# EAGLE design Breakout2-rc-1-9 (EAGLE 5.12)
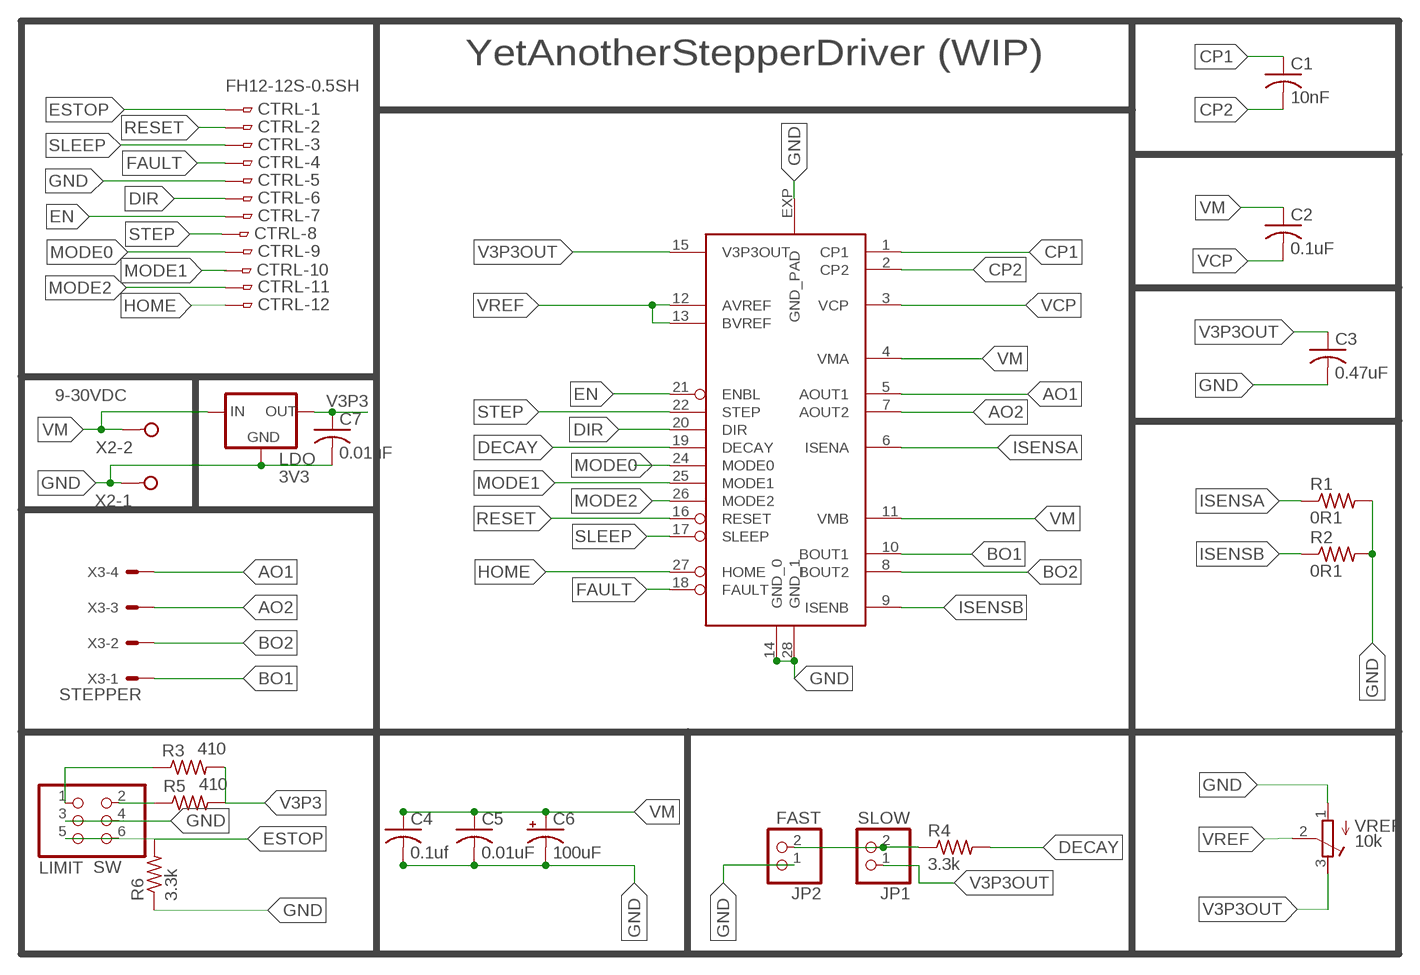
[diagram p0: schematic, sheet 1]

## Parts
C1  10nF  C-USC0805K  [C0805K]
C2  0.1uF  C-USC0805  [C0805]
C3  0.47uF  C-USC0805  [C0805]
C4  0.1uf  C-USC1206  [C1206]
C5  0.01uF  C-USC0805  [C0805]
C6  100uF  CPOL-USE5-8.5  [E5-8,5]
C7  0.01uF  C-USC0805  [C0805]
CTRL  FH12-12S-0.5SH  [FH12-12S-0.5SH]
JP1  SLOW  PINHD-1X2  [1X02]
JP2  FAST  PINHD-1X2  [1X02]
LDO  3V3  78LXX  [78LXX]
R1  0R1  R-US_R2512  [R2512]
R2  0R1  R-US_R2512  [R2512]
R3  410  R-US_R0805  [R0805]
R4  3.3k  R-US_R0805  [R0805]
R5  410  R-US_R0805  [R0805]
R6  3.3k  R-US_R0805  [R0805]
SW  LIMIT  PINHD-2X3  [2X03]
U1  DRV8825PWP  [TSSOP-28]
VREF  10k  R-TRIMM3304W  [RTRIM3304W]
X2  9-30VDC  W237-02P  [W237-132]
X3  STEPPER  KK-156-4  [KK-156-4]

## Nets
AO1: U1.5(AOUT1) X3.4
AO2: U1.7(AOUT2) X3.3
BO1: U1.10(BOUT1) X3.1
BO2: U1.8(BOUT2) X3.2
CP1: C1.1 U1.1(CP1)
CP2: C1.2 U1.2(CP2)
DECAY: R4.2 U1.19(DECAY)
DIR: CTRL.6 U1.20(DIR)
EN: CTRL.7 U1.21(ENBL)
ESTOP: CTRL.1 R6.2 SW.5 SW.6
FAULT: CTRL.4 U1.18(FAULT)
GND: C3.2 C4.2 C5.2 C6.- C7.2 CTRL.5 JP2.1 LDO.GND R1.2 R2.2 R6.1 SW.3 SW.4 U1.14(GND_0) U1.28(GND_1) U1.EXP(GND_PAD) VREF.1(A) X2.1
HOME: CTRL.12 U1.27(HOME)
ISENSA: R1.1 U1.6(ISENA)
ISENSB: R2.1 U1.9(ISENB)
MODE0: CTRL.9 U1.24(MODE0)
MODE1: CTRL.10 U1.25(MODE1)
MODE2: CTRL.11 U1.26(MODE2)
N$1: R5.1 SW.2
N$4: JP1.2 JP2.2 R4.1
N$7: R3.1 SW.1
RESET: CTRL.2 U1.16(RESET)
SLEEP: CTRL.3 U1.17(SLEEP)
STEP: CTRL.8 U1.22(STEP)
V3P3: C7.1 LDO.OUT R3.2 R5.2
V3P3OUT: C3.1 JP1.1 U1.15(V3P3OUT) VREF.3(E)
VCP: C2.2 U1.3(VCP)
VM: C2.1 C4.1 C5.1 C6.+ LDO.IN U1.4(VMA) U1.11(VMB) X2.2
VREF: U1.12(AVREF) U1.13(BVREF) VREF.2(S)

## Notes on the sheet
- YetAnotherStepperDriver (WIP)

## Library data of the parts
C1-C5 C7 = rcl:C-US: CAPACITOR, American symbol
C6 = rcl:CPOL-US: POLARIZED CAPACITOR, American symbol
CTRL = con-hirose:FH12-12S-0.5S: 0.5mm Pitch Connectors For FPC/FFC Source: Data sheet <http://www.hirose.co.jp/cataloge_hp/e58605370.pdf>; MPN: FH12-12S-0.5SH(55); OC_FARNELL: 1324542; OC_NEWARK: 34M6155
JP1 JP2 = pinhead:PINHD-1X2: PIN HEADER
LDO = v-reg:78LXX: VOLTAGE REGULATOR
R1-R6 = rcl:R-US_: RESISTOR, American symbol
SW = pinhead:PINHD-2X3: PIN HEADER
U1 = drv88xx:DRV8825PWP
VREF = rcl:R-TRIMM: Trimm resistor
X2 = con-wago-508:W237-02P: WAGO SREW CLAMP; OC_FARNELL: unknown; OC_NEWARK: unknown
X3 = con-molex:KK-156-4: KK 156 HEADER Source: http://www.molex.com/pdm_docs/sd/026604100_sd.pdf; OC_FARNELL: unknown; OC_NEWARK: unknown

## Board
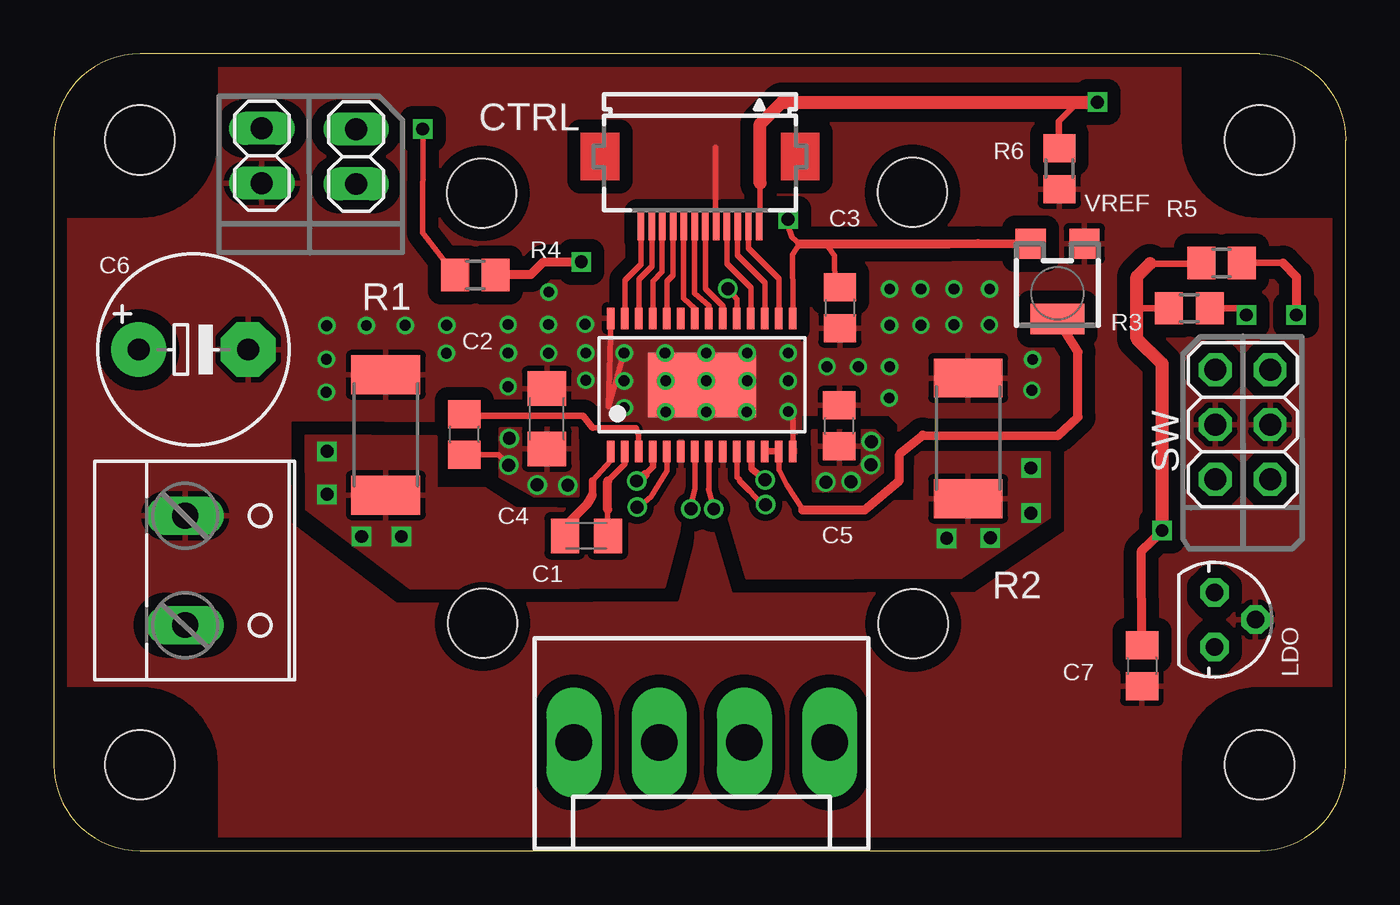
[diagram p1: board, top side]
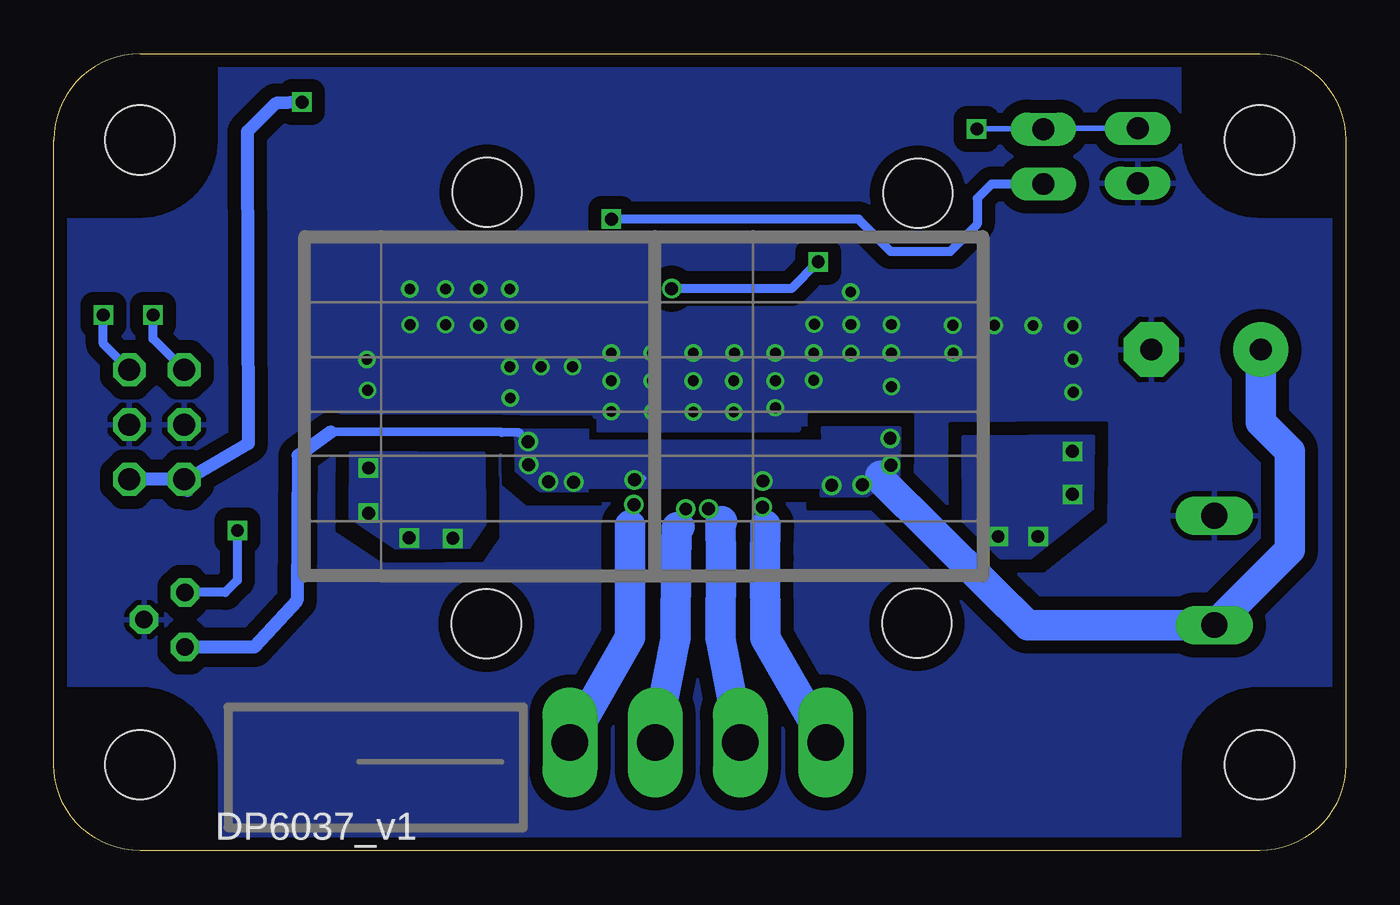
[diagram p2: board, bottom side, seen from below]

Size 60 x 37 mm. Coordinates in mm from the lower left corner, seen from the top.
Copper layers (1*16): Top 0.035mm / dielectric 1.5mm / Bottom 0.035mm
Design rules "Fusion_eagle_rule_v1.1": minimum track width 6mil, minimum drill 12mil, track to track 6mil, track to pad 6mil, pad to pad 6mil, via to via 6mil, smd to smd 0mil, copper to edge 10mil, drill to drill 10mil, minimum pad ring 10mil, minimum via ring 6mil, stop-mask expansion 2mil, vias tented up to drill 100mil, thermal gap 10mil
Holes 3.2 mm at 19.92,10.56 19.88,30.52 39.87,30.58 39.91,10.53

### Footprints (pad centres in the part's own frame; a part is rotated, then mirrored left to right if it is on the bottom)
C0805K = smd 1.3 x 1.6: 1 -1,0; 2 1,0
C0805 = smd 1.3 x 1.5: 1 -0.95,0; 2 0.95,0
C1206 = smd 1.6 x 1.8: 1 -1.4,0; 2 1.4,0
E5-8,5 = drill 1.016 pad 2.54 round: + -2.54,0 | drill 1.016 pad 2.54 octagon: - 2.54,0
FH12-12S-0.5SH = smd 0.3 x 1.3: 1 -2.75,3.25; 2 -2.25,3.25; 3 -1.75,3.25; 4 -1.25,3.25; 5 -0.75,3.25; 6 -0.25,3.25; 7 0.25,3.25; 8 0.75,3.25; 9 1.25,3.25; 10 1.75,3.25; 11 2.25,3.25; 12 2.75,3.25
1X02 = drill 1.016 long: 1 -1.27,0; 2 1.27,0
78LXX = drill 0.813 octagon: GND 0,1.905; IN 1.27,0; OUT -1.27,0
R2512 = smd 1.8 x 3.2: 1 -2.8,0; 2 2.8,0
R0805 = smd 1.3 x 1.5: 1 -0.95,0; 2 0.95,0
2X03 = drill 1.016 octagon: 1 -2.54,-1.27; 2 -2.54,1.27; 3 0,-1.27; 4 0,1.27; 5 2.54,-1.27; 6 2.54,1.27
TSSOP-28 = smd 0.35 x 1: 1 -4.225,-3.087; 2 -3.575,-3.087; 3 -2.925,-3.087; 4 -2.275,-3.087; 5 -1.625,-3.087; 6 -0.975,-3.087; 7 -0.325,-3.087; 8 0.325,-3.087; 9 0.975,-3.087; 10 1.625,-3.087; 11 2.275,-3.087; 12 2.925,-3.087; 13 3.575,-3.087; 14 4.225,-3.087; 15 4.225,3.087; 16 3.575,3.087; 17 2.925,3.087; 18 2.275,3.087; 19 1.625,3.087; 20 0.975,3.087; 21 0.325,3.087; 22 -0.325,3.087; 23 -0.975,3.087; 24 -1.625,3.087; 25 -2.275,3.087; 26 -2.925,3.087; 27 -3.575,3.087; 28 -4.225,3.087 | smd 5 x 3: EXP 0,0
DP6037_V1 = hole 3.2: 4,4; 56,4; 56,33; 4,33
RTRIM3304W = smd 1.4 x 1.4: 1 -1.25,-1.9; 3 1.25,-1.9 | smd 2.5 x 1.4: 2 0,1.6
W237-132 = drill 1.194 long: 1 -2.54,-0.635; 2 2.54,-0.635
KK-156-4 = drill 1.7 pad 2.184 long: 1 -5.94,0; 2 -1.98,0; 3 1.98,0; 4 5.94,0

### Placement (x,y rotation side)
C1  24.74,14.62 0 top
C2  19.07,19.33 90 top
C3  36.51,25.22 270 top
C4  22.9,20.06 90 top
C5  36.48,19.72 90 top
C6  6.48,23.27 0 top
C7  50.54,8.58 270 top
CTRL  30.01,32.23 180 top
JP1  14.04,32.23 90 top
JP2  9.66,32.27 90 top
LDO  53.91,10.73 270 top
R1  15.41,19.3 90 top
R2  42.46,19.15 90 top
R3  52.74,25.19 180 top
R4  19.58,26.74 0 top
R5  54.23,27.29 180 top
R6  46.7,31.67 90 top
SW  55.22,19.79 270 top
U1  30.1,21.63 0 top
U$1  [DP6037_V1]  0,0 0 top
VREF  46.62,26.29 180 top
X2  6.74,13.02 270 top
X3  30.09,5.03 180 top

### Tracks (layer width: path | path; a pad name or v marks a point on that pad's centre or on a via)
AO1  (via drill 0.6)
  Top 0.254: U1.5 28.48,17.63 27.73,16.43 27.44,16.18 v27.1,15.94 27.08,15.98
  Top 0.61: v27.09,15.95 27.08,15.98
  Bottom 0.61: 26.94,15.11 27,15.16 v27.09,15.95
  Bottom 1.422: 26.94,15.11 26.96,13.57 26.94,9.88 X3.4
AO2  (via drill 0.6)
  Top 0.254: U1.7 29.78,17.66 29.79,16.82 29.54,15.85
  Top 0.61: v29.59,15.88 29.54,15.85
  Bottom 0.61: v29.59,15.88 29.43,15.48 28.98,15.31
  Bottom 1.422: 28.98,15.31 29.03,15.11 29,13.64 29.03,9.86 X3.3
BO1  (via drill 0.6)
  Top 0.254: 33.01,16.07 32.82,16.15 32.31,16.72 31.84,17.19 31.84,17.24 31.73,17.35 U1.10
  Top 0.813: v33.05,16.07 33.01,16.07
  Bottom 0.61: 33.24,15.11 v33.05,16.07
  Bottom 1.422: X3.1 33.23,9.91 33.24,13.64 33.24,15.11
BO2  (via drill 0.6)
  Top 0.254: U1.8 30.43,17.67 30.43,16.82 30.4,16.78 30.63,16.04 v30.65,15.87
  Top 0.813: v30.65,15.87
  Bottom 0.61: 31.06,15.01 v30.65,15.87
  Bottom 1.422: 30.93,15.03 31.06,15.01 31.1,13.63 31.12,9.87 X3.2
CP1
  Top 0.254: U1.1 25.85,18.11 25.01,17.17 | 24.78,16.12 24.46,15.8 | 24.78,16.12
  Top 0.356: 25.01,16.51 25.01,17.17
  Top 0.406: C1.1 23.74,15.08 24.78,16.12 25.01,16.51
CP2
  Top 0.254: U1.2 26.53,17.96 25.72,17.16 | C1.2 25.72,15.84
  Top 0.406: 25.72,15.84 25.72,17.16
DECAY  (via drill 0.6)
  Top 0.254: U1.19 31.73,25.6 v31.31,26.1
  Top 0.406: v24.5,27.34 22.75,27.34 22.16,26.76 20.55,26.76 R4.2
  Bottom 0.406: v31.31,26.1 25.74,26.1 v24.5,27.34
DIR
  Top 0.254: U1.20 31.08,25.28 30.26,26.1 CTRL.6
EN
  Top 0.254: U1.21 30.43,25.3 29.76,25.89 29.76,28.91 CTRL.7
ESTOP  (via drill 0.6)
  Top 0.254: 32.8,31 32.8,29.03 CTRL.1
  Top 0.305: v48.48,34.76 47.56,34.76 46.67,33.87 46.67,32.65 R6.2
  Top 0.61: v48.48,34.76 33.82,34.76 32.8,33.74 32.8,31
  Bottom 0.406: 53.79,16.72 53.79,17.08 SW.5
  Bottom 0.61: SW.5 SW.6 | 53.79,16.72 53.84,17.23 50.97,18.91 51.02,33.39 49.7,34.71 v48.48,34.76
FAULT
  Top 0.254: U1.18 32.38,26.14 31.26,27.26 CTRL.4
GND  (via drill 0.5)
  Top 0.254: U1.14 34.33,20.35 v34.11,20.39 | U1.28 25.77,20.61 v26.49,23.11 | CTRL.5 30.74,29.01 30.74,32.66
  other vias: 30.3,23.11 28.39,23.11 28.42,21.82 28.42,20.37 26.49,20.57 26.49,21.82 32.2,23.11 30.3,21.82 34.11,23.11 32.2,21.82 32.18,20.37 30.3,20.37 34.11,21.82 35.91,22.48 37.37,22.47 24.71,21.84 24.71,23.11 22.99,25.95 22.97,23.1 21.1,21.55 21.1,24.43 21.1,23.11 18.23,23.1 18.25,24.4 24.68,24.44 22.97,24.44 12.65,21.29 14.52,24.39 16.32,24.39 12.66,22.82 12.68,24.38 45.46,22.81 45.43,21.38 38.8,21.02 38.82,24.4 38.82,22.47 38.82,26.08 40.27,26.08 40.27,24.4 41.8,24.42 43.46,24.42 41.8,26.08 43.46,26.08
  pour Top (isolate 0.61, rank 2): 0.06,-0.14 59.98,-0.14 59.98,36.94 -0.01,36.94 -0.01,1.15
  pour Bottom (isolate 0.61, rank 2): 0.06,-0.14 59.98,-0.14 59.98,36.94 -0.01,36.94 -0.01,1.15
  pour Top (no thermals): 25.48,23.66 34.59,23.73 34.64,19.65 25.53,19.67
  pour Top (no thermals): 25.37,20.72 25.83,20.9 25.83,20.88
  pour Bottom (no thermals): 25.41,19.49 34.73,19.49 34.73,20.13 34.89,20.13 34.84,23.73 25.36,23.73 25.36,19.54
HOME
  Top 0.254: U1.27 26.53,26.5 27.27,27.24 CTRL.12
ISENSA  (via drill 0.6)
  other vias: 12.69,18.55 12.69,16.55 16.14,14.59 14.29,14.59
  pour Top (isolate 0.305): 11.73,15.87 16.58,12.19 28.34,12.27 29,14.78 29.56,19.05 27.1,19.05 27.3,15.82 21.41,15.9 20,16.82 17.76,16.81 17.75,19.23 11.71,19.26
  pour Bottom: 17.73,19.17 11.77,19.22 11.82,15.89 14.66,13.62 15.98,13.64 17.7,15.35
ISENSB  (via drill 0.6)
  other vias: 45.38,17.77 45.38,15.68 43.49,14.53 41.47,14.51
  pour Top (isolate 0.305): 40.03,18.48 46.25,18.48 46.24,15.49 42.16,12.7 32.2,12.65 30.45,18.54 31.9,18.54 32.25,16.15 40,16.23
  pour Bottom: 40.06,18.41 40.04,15.16 40.74,14.13 44.1,14.09 46.18,15.47 46.17,18.45
MODE0
  Top 0.254: U1.24 28.48,26.44 28.77,26.73 CTRL.9
MODE1
  Top 0.254: U1.25 27.83,26.45 28.26,26.88 CTRL.10
MODE2
  Top 0.254: U1.26 27.18,26.54 27.78,27.14 27.78,28.97 CTRL.11
N$1  (via drill 0.6)
  Top 0.305: 57.08,27.29 R5.1 | v57.7,24.88 57.72,25.16
  Top 0.406: 57.08,27.29 57.72,26.63 57.72,25.16
  Bottom 0.406: v57.7,24.88 57.7,23.53 SW.2
N$4  (via drill 0.6)
  Top 0.254: R4.1 17.13,28.69 17.15,33.49 v17.13,33.51
  Bottom 0.254: v17.13,33.51 JP1.2 14,33.54 JP2.2
N$7  (via drill 0.6)
  Top 0.305: R3.1 55.07,25.19 v55.39,24.88
  Bottom 0.406: v55.39,24.88 55.39,23.76 SW.1
RESET
  Top 0.254: U1.16 33.68,26.57 32.27,27.98 CTRL.2
SLEEP
  Top 0.254: U1.17 33.03,26.38 31.76,27.64 CTRL.3 | CTRL.3
STEP
  Top 0.254: U1.22 29.78,25.16 29.25,25.66 29.25,28.94 CTRL.8
V3P3  (via drill 0.6)
  Top 0.305: 50.91,27.26 53.26,27.26 R5.2 | R3.2 50.35,25.19 50.31,25.23
  Top 0.406: C7.1 50.51,13.93 v51.47,14.87
  Top 0.61: v51.47,14.87 51.47,22.62 50.31,23.78 50.31,25.23 50.31,26.65 50.91,27.26
  Bottom 0.406: LDO.OUT 52.03,12 51.47,12.56 v51.47,14.87
V3P3OUT  (via drill 0.6)
  Top 0.254: v34.1,29.32 34.09,29.09 34.28,28.49 34.63,28.18 34.3,27.67 34.33,25.44 U1.15 | C3.1 36.29,26.2 36.27,27.62 35.87,28.18
  Top 0.406: 34.63,28.18 35.87,28.18 41.56,28.18 42.94,28.2 VREF.3
  Bottom 0.406: v34.1,29.32 22.62,29.32 21.12,27.82 18.38,27.82 17.11,29.09 17.11,30.29 16.45,30.95 14.05,30.95 JP1.1
VCP
  Top 0.254: U1.3 27.16,19.32 27.03,19.64 25.02,19.64
  Top 0.305: 25.02,19.64 24.58,20.19 19.73,20.19 19.65,20.28 C2.2
VM  (via drill 0.6)
  Top 0.254: C2.1 20.66,18.38 v21.13,17.9
  Top 0.305: U1.4 27.83,17.82 27.48,17.47 | U1.11 32.41,17.73 v33.05,17.21 | 32.89,17.22 v33.04,17.22
  Top 0.406: 27.48,17.47 27.17,17.17
  Top 0.61: 27.17,17.17 v27.07,17.17 | v33.05,17.21 32.89,17.22
  Bottom 0.305: v27.07,17.17 27.05,17.17 | v33.04,17.22 32.63,17.3 | v37.97,19 38.38,19.41
  Bottom 0.406: 47.13,19.45 39.18,19.43 38.38,19.41
  Bottom 0.61: 47.13,19.45 48.65,18.34 48.71,11.62 50.69,9.46 LDO.IN
  Bottom 1.422: 21.61,17.42 21.61,17.24 16.49,12.2 14.77,10.48 X2.2 2.6,13.97 2.6,18.55 3.94,19.89 C6.+
  other vias: 23.87,16.96 22.45,16.99 21.15,19.15 35.86,17.12 37.03,17.14 37.94,17.93
  pour Bottom (isolate 0.305): 20.71,19.63 20.75,17.42 22.26,16.49 24.37,16.48 24.34,16.87 35.25,16.89 35.23,16.69 37.43,16.71 38.5,17.63 38.55,19.56 37.13,19.52 35.22,19.52 35.22,19.01 24.28,19.01 24.31,19.64
  pour Top: 20.73,19.6 20.72,17.37 22.3,16.48 24.35,16.48 24.35,17.63 24.3,19.62 21.74,19.62
  pour Top (isolate 0.305): 35.23,19.5 35.28,16.71 37.43,16.71 38.48,17.57 38.48,19.15 38.11,19.53
VREF
  Top 0.254: U1.13 33.68,17.7 34.06,16.97 34.79,15.82
  Top 0.305: U1.12 U1.13
  Top 0.406: 34.79,15.82 37.66,15.82 39.27,17.19 39.27,18.34 39.32,18.46 40.36,19.3 46.63,19.27 47.57,20.13 47.57,23.16 VREF.2

### Text on the board
Measures: 20mm | 5.3 | 6.5mm | 4.75 | 10.5mm
tDocu: 1 | FAST | SLOW | DECAY | - | 1 | 2 | B1 | A1 | A2 | B2 | + | - | YASD V0.3
bDocu: nENAB | 7 | LSWITCH | 1 | STEP | 8 | nRESET | 2 | MODE0 | 9 | nSLEEP | 3 | MODE1 | 10 | nFAULT | 4 | MODE2 | 11 | GND | 5 | nHOME | 12 | DIR | 6 | VREF | Ichop= | 5*Risense